# Altium schematic sheet Sheet2.SCHDOC
size 840 x 594 mm; SheetNumber: 2; SheetTotal: 5; DocumentName: Sheet2.SCHDOC
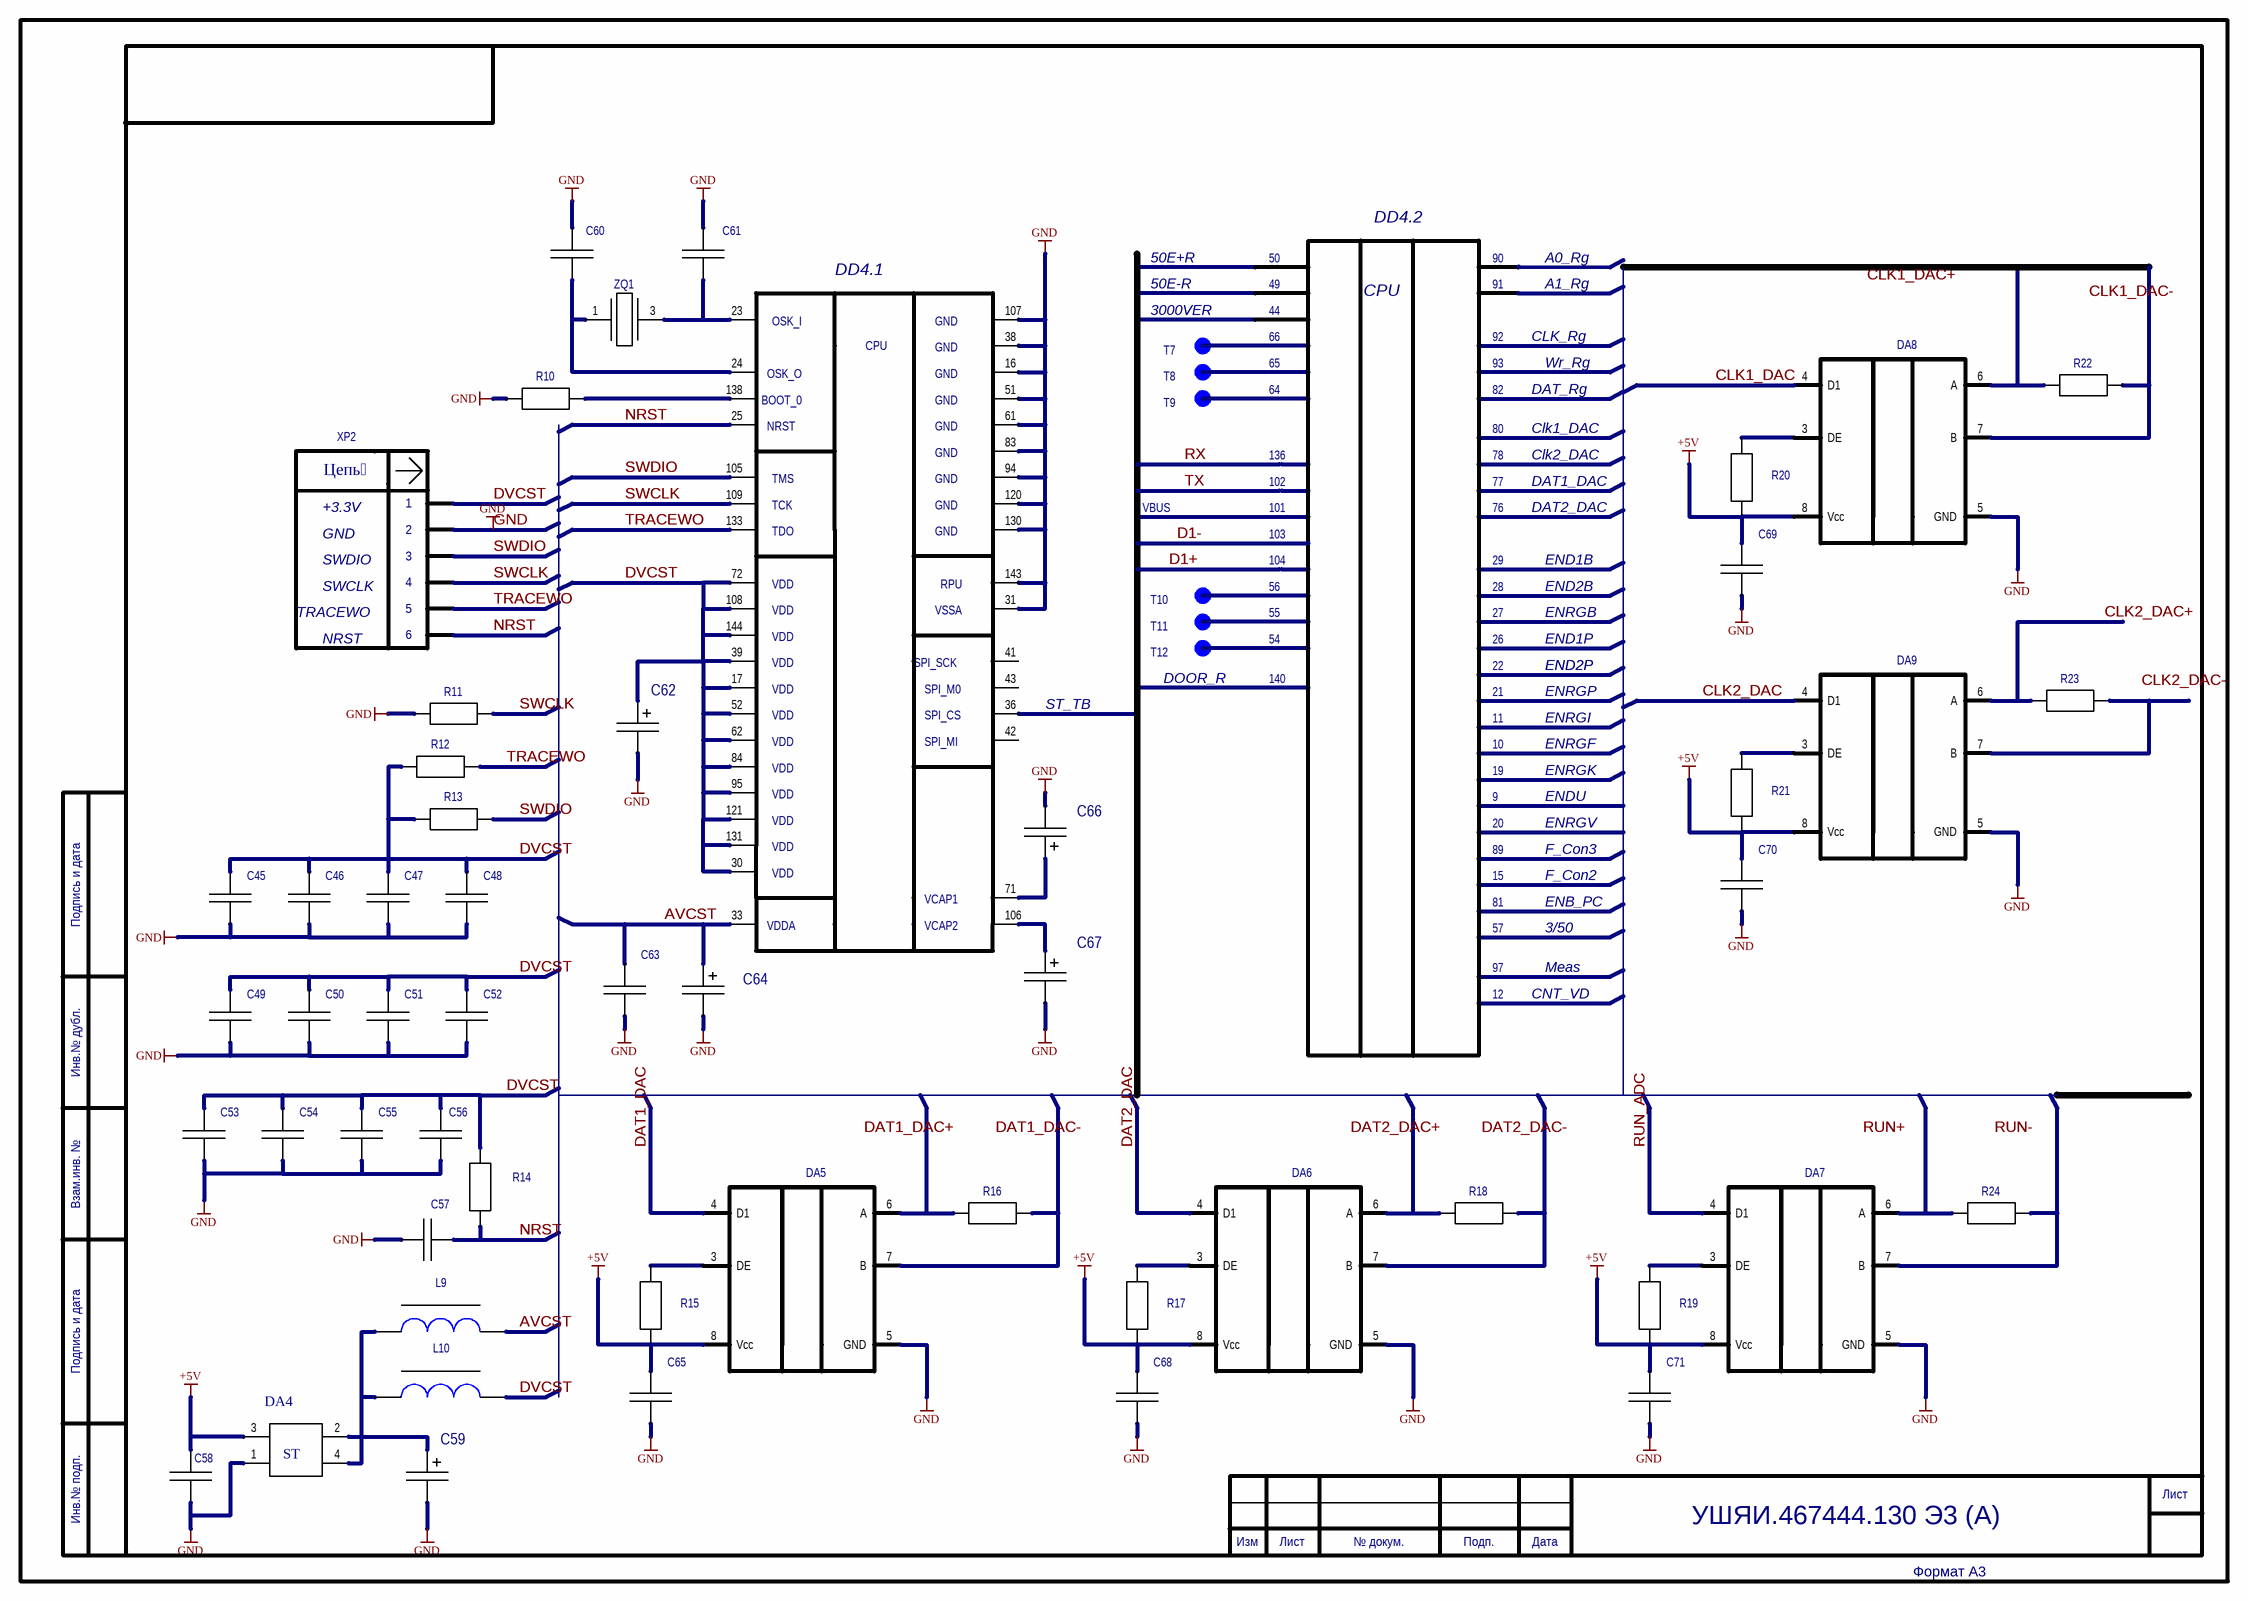
[diagram p0: Sheet2.SCHDOC]

## Parts
C45  GRM21BR71H104KA01L  (value not drawn)
C46  GRM21BR71H104KA01L  (value not drawn)
C47  GRM21BR71H104KA01L  (value not drawn)
C48  GRM21BR71H104KA01L  (value not drawn)
C49  GRM21BR71H104KA01L  (value not drawn)
C50  GRM21BR71H104KA01L  (value not drawn)
C51  GRM21BR71H104KA01L  (value not drawn)
C52  GRM21BR71H104KA01L  (value not drawn)
C53  GRM21BR71H104KA01L  (value not drawn)
C54  GRM21BR71H104KA01L  (value not drawn)
C55  GRM21BR71H104KA01L  (value not drawn)
C56  GRM21BR71H104KA01L  (value not drawn)
C57  GRM21BR71H104KA01L  (value not drawn)
C58  GRM21BR71H104KA01L  (value not drawn)
C59  TAJB475K020  (value not drawn)
C60  805-CG-20 ПФ  (value not drawn)
C61  805-CG-20 ПФ  (value not drawn)
C62  TAJB106M016  (value not drawn)
C63  GRM21BR71H104KA01L  (value not drawn)
C64  TAJB106M016  (value not drawn)
C65  GRM21BR71H104KA01L  (value not drawn)
C66  TAJA225M016  (value not drawn)
C67  TAJA225M016  (value not drawn)
C68  GRM21BR71H104KA01L  (value not drawn)
C69  GRM21BR71H104KA01L  (value not drawn)
C70  GRM21BR71H104KA01L  (value not drawn)
C71  GRM21BR71H104KA01L  (value not drawn)
DA4  LD1117AS33TR  (value not drawn)
DA5  ADM483  (value not drawn)
DA6  ADM483  (value not drawn)
DA7  ADM483  (value not drawn)
DA8  ADM483  (value not drawn)
DA9  ADM483  (value not drawn)
DD4.2  STM32F407ZGTX-A  (value not drawn)
L9  ILBB0805ER601V  (value not drawn)
L10  ILBB0805ER601V  (value not drawn)
R10  0805-10 KОМ+-5%  [0805]  (value not drawn)
R11  0805-10 KОМ+-5%  [0805]  (value not drawn)
R12  0805-10 KОМ+-5%  [0805]  (value not drawn)
R13  0805-10 KОМ+-5%  [0805]  (value not drawn)
R14  0805-10 KОМ+-5%  [0805]  (value not drawn)
R15  0805-10 KОМ+-5%  [0805]  (value not drawn)
R16  0805-10 KОМ+-5%  [0805]  (value not drawn)
R17  0805-10 KОМ+-5%  [0805]  (value not drawn)
R18  0805-10 KОМ+-5%  [0805]  (value not drawn)
R19  0805-10 KОМ+-5%  [0805]  (value not drawn)
R20  0805-10 KОМ+-5%  [0805]  (value not drawn)
R21  0805-10 KОМ+-5%  [0805]  (value not drawn)
R22  0805-10 KОМ+-5%  [0805]  (value not drawn)
R23  0805-10 KОМ+-5%  [0805]  (value not drawn)
R24  0805-10 KОМ+-5%  [0805]  (value not drawn)
T16  ТОЧКА ПАЙКИ 1  [LEPESTOK7_750_224]  (value not drawn)
T17  ТОЧКА ПАЙКИ 1  [LEPESTOK7_750_224]  (value not drawn)
T18  ТОЧКА ПАЙКИ 1  [LEPESTOK7_750_224]  (value not drawn)
T19  ТОЧКА ПАЙКИ 1  [LEPESTOK7_750_224]  (value not drawn)
T22  ТОЧКА ПАЙКИ 1  [LEPESTOK7_750_224]  (value not drawn)
T23  ТОЧКА ПАЙКИ 1  [LEPESTOK7_750_224]  (value not drawn)
XP2  AMP II 280372-2  (value not drawn)
ZQ1  QUARZ JXS63  [JXS63]  (value not drawn)

## Nets
+5V: C58.2 C65.2 C68.2 C69.2 C70.2 C71.2 DA4.3 DA5.8(Vcc) DA6.8(Vcc) DA7.8(Vcc) DA8.8(Vcc) DA9.8(Vcc) R15.1 R17.1 R19.1 R20.1 R21.1
GND: C45.1 C46.1 C47.1 C48.1 C49.1 C50.1 C51.1 C52.1 C53.1 C54.1 C55.1 C56.1 C57.2 C58.1 C59.2 C60.2 C61.2 C62.2 C63.1 C64.2 C65.1 C66.2 C67.2 C68.1 C69.1 C70.1 C71.1 DA4.1 DA5.5(GND) DA6.5(GND) DA7.5(GND) DA8.5(GND) DA9.5(GND) DD4.2.16 DD4.2.31 DD4.2.38 DD4.2.51 DD4.2.61 DD4.2.83 DD4.2.94 DD4.2.107 DD4.2.120 DD4.2.130 DD4.2.143 R10.1 R11.1 XP2.2
AVCST: C63.2 C64.1 DD4.2.33 L9.2
CLK1_DAC: DA8.4(D1)
CLK2_DAC: DA9.4(D1)
CLK2_DAC+: DA9.6(A) R23.1
DAT1_DAC: DA5.4(D1)
DAT2_DAC: DA6.4(D1)
DVCST: C45.2 C46.2 C47.2 C48.2 C49.2 C50.2 C51.2 C52.2 C53.2 C54.2 C55.2 C56.2 C62.1 DD4.2.17 DD4.2.30 DD4.2.39 DD4.2.52 DD4.2.62 DD4.2.72 DD4.2.84 DD4.2.95 DD4.2.108 DD4.2.121 DD4.2.131 DD4.2.144 L10.2 R12.1 R13.1 R14.2 XP2.1
NRST: C57.1 DD4.2.25 R14.1 XP2.6
RUN_ADC: DA7.4(D1)
SWCLK: DD4.2.109 R11.2 XP2.4
SWDIO: DD4.2.105 R13.2 XP2.3
TRACEWO: DD4.2.133 R12.2 XP2.5
NetC59_1: C59.1 DA4.2 DA4.4 L9.1 L10.1
NetC60_1: C60.1 DD4.2.24 ZQ1.1
NetC61_1: C61.1 DD4.2.23 ZQ1.3
NetC66_1: C66.1 DD4.2.71
NetC67_1: C67.1 DD4.2.106
NetDA5_3: DA5.3(DE) R15.2
NetDA5_6: DA5.6(A) R16.1
NetDA5_7: DA5.7(B) R16.2
NetDA6_3: DA6.3(DE) R17.2
NetDA6_6: DA6.6(A) R18.1
NetDA6_7: DA6.7(B) R18.2
NetDA7_3: DA7.3(DE) R19.2
NetDA7_6: DA7.6(A) R24.1
NetDA7_7: DA7.7(B) R24.2
NetDA8_3: DA8.3(DE) R20.2
NetDA8_6: DA8.6(A) R22.1
NetDA8_7: DA8.7(B) R22.2
NetDA9_3: DA9.3(DE) R21.2
NetDA9_7: DA9.7(B) R23.2
NetDD4.2_138: DD4.2.138 R10.2

Not connected (* = marked no-connect by the designer): DD4.2 36 41 42 43; T16 1; T17 1; T18 1; T19 1; T22 1; T23 1; ZQ1 2 4

## Notes on the sheet
- DD4.2
- (near DD4.2) DD4.1
- 50E-R
- 50E+R
- 49
- 50
- 90
- 91
- A1_Rg
- A0_Rg
- (near T16) 3000VER
- T7
- 44
- 66
- CPU
- 92
- CLK_Rg
- T9
- T8
- 64
- 65
- 82
- 93
- DAT_Rg
- Wr_Rg
- 102
- 136
- 77
- 80
- 78
- DAT1_DAC
- Clk1_DAC
- Clk2_DAC
- +3.3V
- GND
- VBUS
- 101
- 103
- 76
- DAT2_DAC
- TRACEWO
- SWDIO
- SWCLK
- T10
- 104
- 56
- 55
- 29
- 28
- 27
- END1B
- END2B
- ENRGB
- NRST
- T12
- T11
- (near T23) DOOR_R
- 140
- 54
- 26
- 22
- 21
- END1P
- END2P
- ENRGP
- (near DD4.2) ST_TB
- 11
- 10
- ENRGI
- ENRGF
- 9
- 20
- 19
- ENDU
- ENRGV
- ENRGK
- Подпись и дата
- 15
- 89
- F_Con2
- F_Con3
- 81
- 57
- 3/50
- ENB_PC
- 12
- 97
- CNT_VD
- Meas
- Инв.№ дубл.
- Взам.инв. №
- Инв.№ подп.
- Лист
- Изм
- № докум.
- Подп.
- Дата
- УШЯИ.467444.130 Э3 (A)
- Формат А3
- Подп. дата
- Инв. № дубл.
- Взам. инв. №
- Подп. и дата
- Инв. № подл.
- Изм.
- ALTIUM GOSTBOM2.0 KEV
- Файл:
- Копировал
- (in symbol AMP II 280372-2) Цепь
- (in symbol LD1117AS33TR) ST
- (in symbol STM32F407ZGTX-A) OSK_I; GND; CPU; OSK_O; BOOT_0; NRST; TMS; TCK; TDO; VDD; RPU; VSSA; SPI_SCK; SPI_M0; SPI_CS; SPI_MI; VCAP1; VDDA; VCAP2

## Library data of the parts
C45-C58 C63 C65 C68-C71 = GRM21BR71H104KA01L: Name2: Конденсатор GRM21BR71H104KA01L; Value: *; Name1: Конденсатор GRM21BR71H104KA01L
C59 = TAJB475K020: Standart: AVX; Name2: Конденсатор  TAJB475K020; Name1: Конденсатор TAJB475K020; Value: *
C60 C61 = 805-CG-20 ПФ: Name2: Конденсатор 805-CG-20 пФ; Name1: Конденсатор 805-CG-20 пФ
C62 C64 = TAJB106M016: Standart: AVX; Name2: Конденсатор  TAJB106M016; Name1: Конденсатор TAJB106M016; Value: *
C66 C67 = TAJA225M016: Standart: AVX; Name2: Конденсатор  TAJA225M016; Name1: Конденсатор TAJA225M016; Value: *
DA5-DA9 = ADM483: Standart: Analog Devices; Name2: ADM483AR; Value: *; Name1: ADM483AR
L9 L10 = ILBB0805ER601V: Standart: MURATA; Name2: Дроссель ILBB0805ER601V; Name1: Дроссель ILBB0805ER601V
R10-R24 = 0805-10 KОМ+-5%: Name1: Резистор 0805-10 кОм+-5%; Name2: Резистор 0805-10 кОм+-5%
T16-T19 T22 T23 = ТОЧКА ПАЙКИ 1: Name: Точка пайки; Value: *
XP2 = AMP II 280372-2: Name2: Вилка AMPMODU II-280379-2 Tyco Electronics; Name1: Вилка AMPMODU II-280379-2  Tyco Electronics; Standart: ELFA (43-836-26); Value: *
ZQ1 = QUARZ JXS63: Standart: Jauch; Name1: Резонатор Q 25.0JXS63-12-30/30-FU Jauch; Name2: Резонатор Q 25.0JXS63-12-30/30-FU; Value: *
DA4 = LD1117AS33TR: Value: *
DD4.2 = STM32F407ZGTX-A: Value: *